# EasyEDA schematic SCH_LightScader-Mini-1.1_2026-06-06.json
TITLE: LightScader Mini; REV: 1.1; Date: 2023-11-19; Sheet: 1/1; Drawn By: robdobsn; Company: Rob Dobson
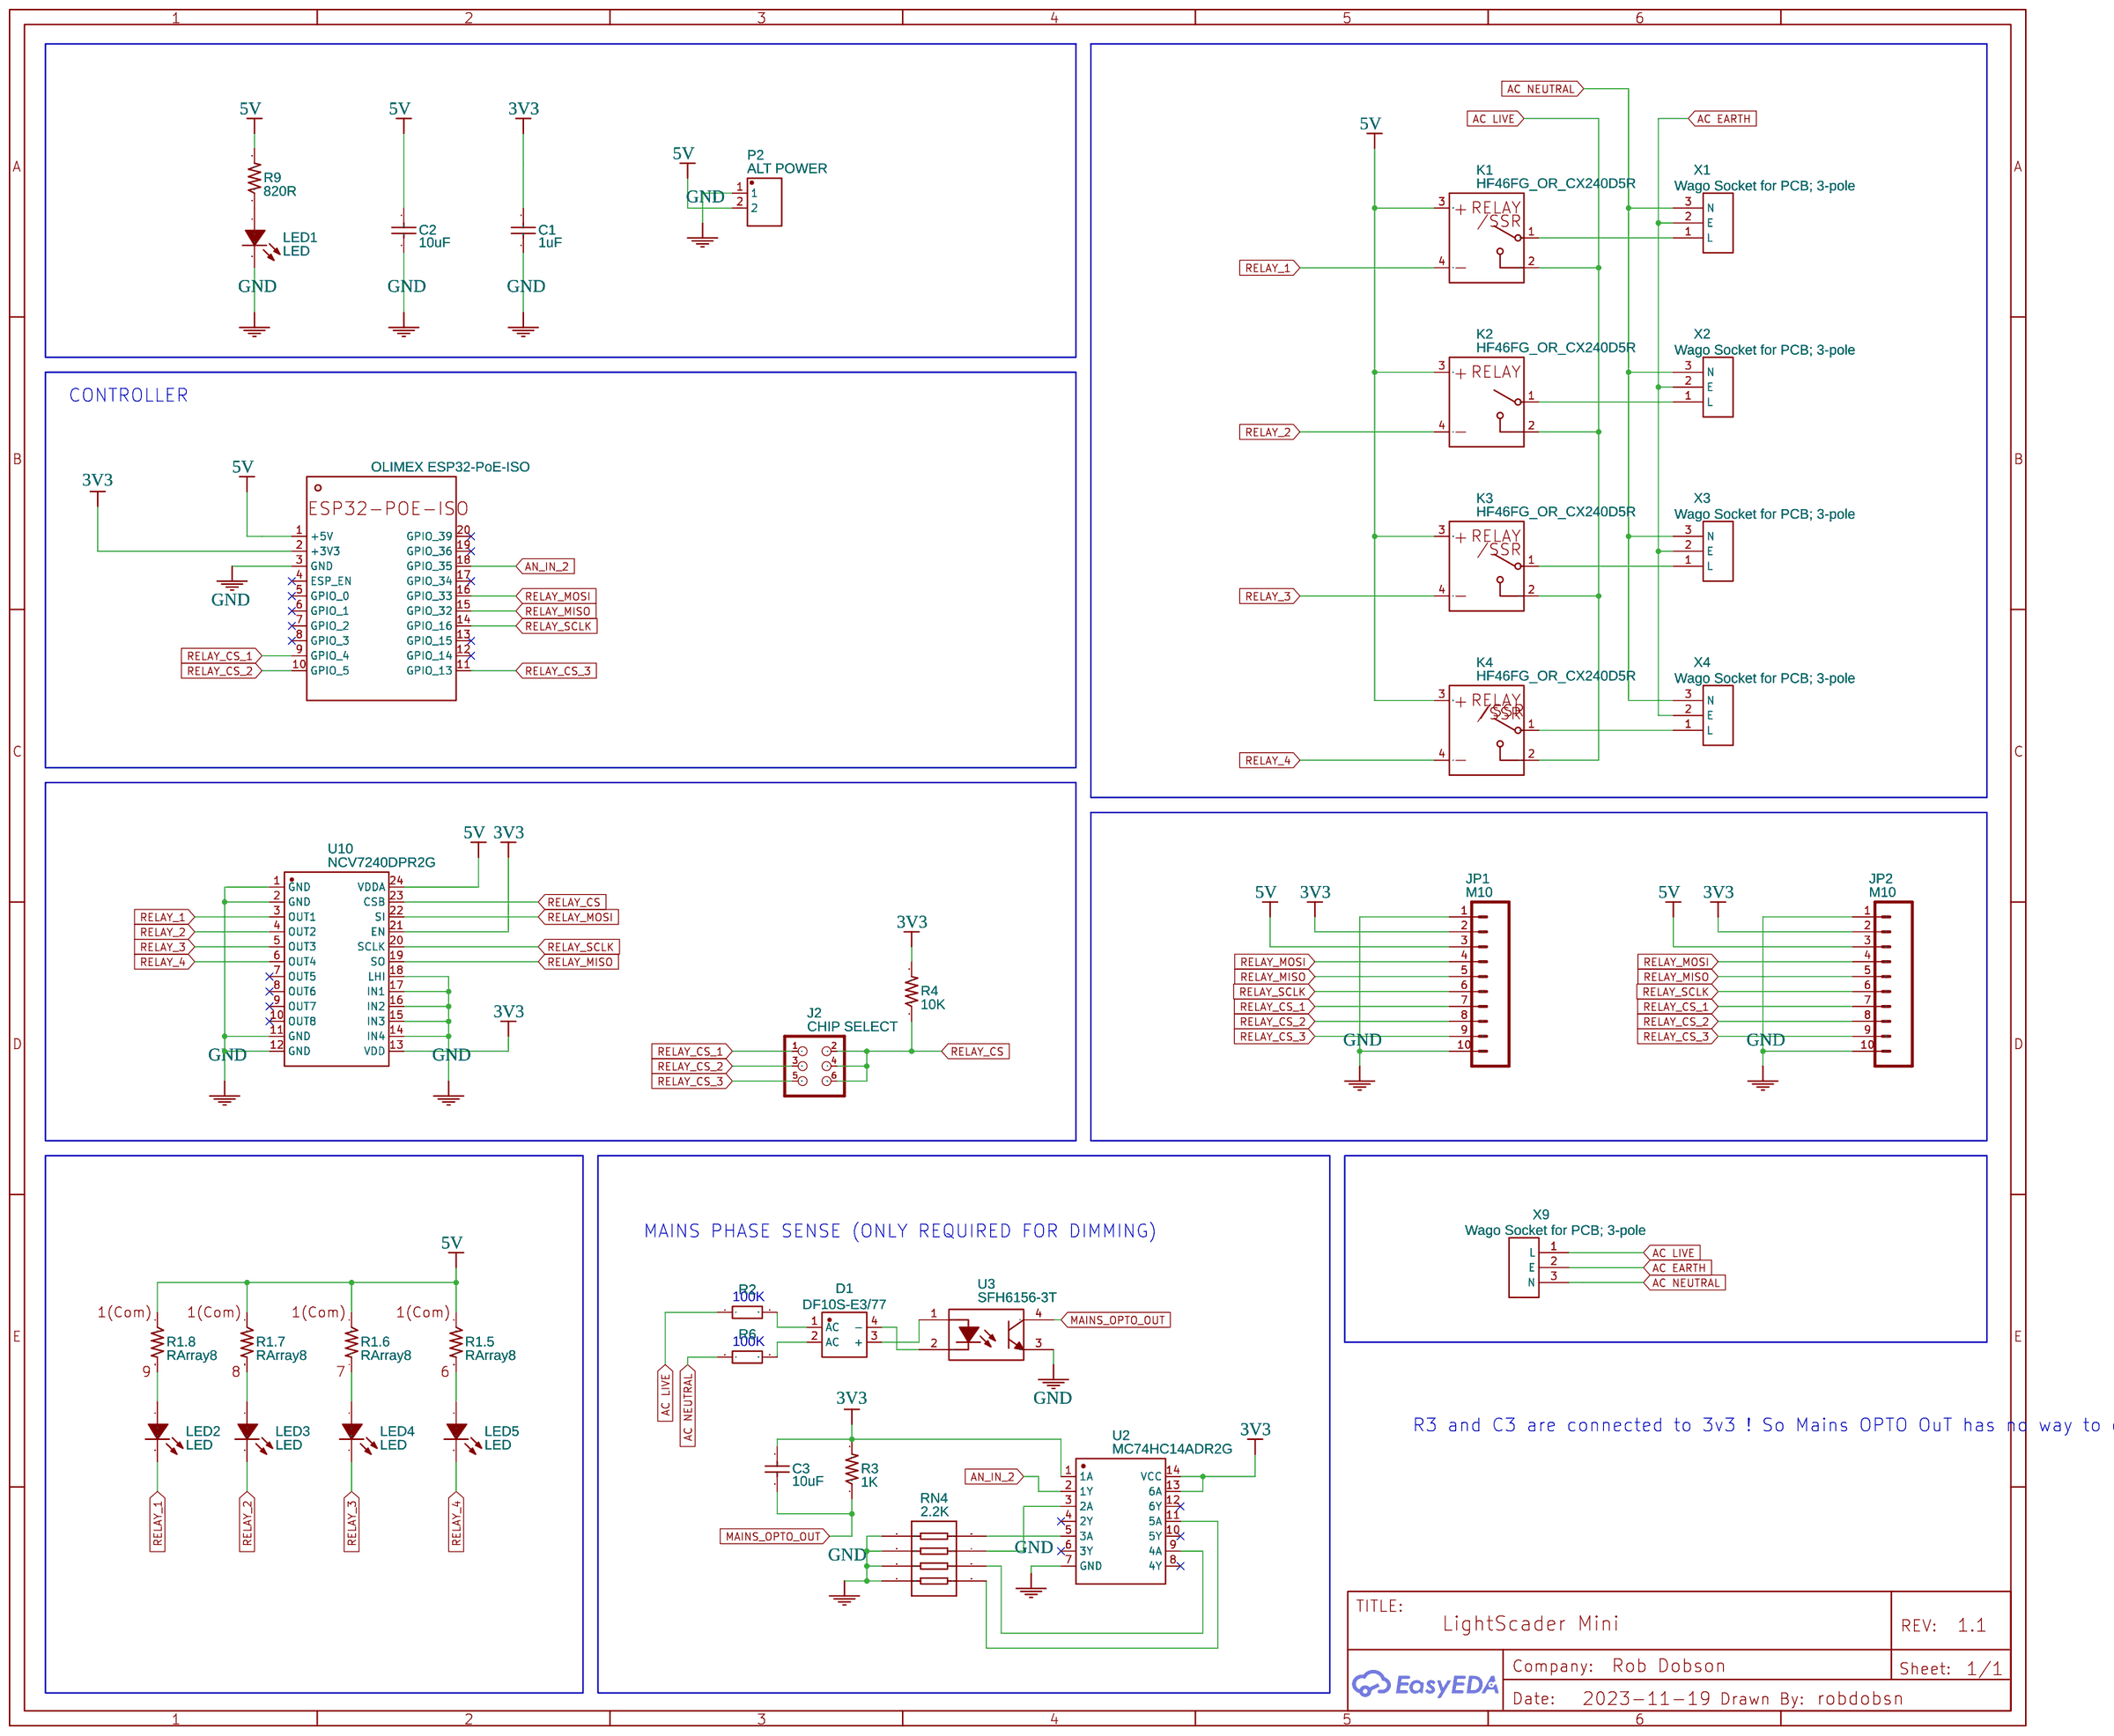
[diagram p0: schematic sheet]

## Parts
C1  1uF  [CERAMIC CAP 2.5MM LEAD SPACING]
C2  10uF  [CERAMIC CAP 2.5MM LEAD SPACING]
C3  10uF  [CERAMIC CAP 2.5MM LEAD SPACING]
D1  DF10S-E3/77  [DFS_4P-L8.3-W6.4-P5.10-LS10.1-BL]
J2  CHIP SELECT  [2X03_NO_SILK]
JP1  M10  [1X10_NO_SILK]
JP2  M10  [1X10_NO_SILK]
K1  HF46FG_OR_CX240D5R  [HF46FG_OR_CX240D5R]
K2  HF46FG_OR_CX240D5R  [HF46FG_OR_CX240D5R]
K3  HF46FG_OR_CX240D5R  [HF46FG_OR_CX240D5R]
K4  HF46FG_OR_CX240D5R  [HF46FG_OR_CX240D5R]
LED1  LED  [LED-TH_BD3.8-P2.54-FD]
LED2  LED  [LED-TH_BD3.8-P2.54-FD]
LED3  LED  [LED-TH_BD3.8-P2.54-FD]
LED4  LED  [LED-TH_BD3.8-P2.54-FD]
LED5  LED  [LED-TH_BD3.8-P2.54-FD]
NO1  OLIMEX ESP32-PoE-ISO  [OLIMEX_ESP32-POE-ISO_98MM_LONG]
P2  ALT POWER  [PCB TERMINAL BLOCK NO SILK 3.5 MM]
R1  RArray8  [RESISTOR_ARRAY_SIP_9]  (sections 5,6,7,8)
R2  NO  [R1206]
R3  1K  [AXIAL-5.0X2.5(1/4W)]
R4  10K  [AXIAL-5.0X2.5(1/4W)]
R6  NO  [R1206]
R9  820R  [AXIAL-5.0X2.5(1/4W)]
RN4  2.2K  [RES-ARRAY-SMD_0603-8P-L3.2-W1.6-BL]
U2  MC74HC14ADR2G  [SOIC-14_L8.7-W3.9-P1.27-LS6.0-BL]
U3  SFH6156-3T  [OPTO-SMD-4_L4.6-W6.5-P2.54-LS10.3-BL]
U10  NCV7240DPR2G  [SSOP-24_L8.75-W6.20-PITCH0.64-BL]
X1  Wago Socket for PCB; 3-pole  [WAGO SOCKET FOR PCBS; ANGLED; 3-POLE; COD. A]
X2  Wago Socket for PCB; 3-pole  [WAGO SOCKET FOR PCBS; ANGLED; 3-POLE; COD. A]
X3  Wago Socket for PCB; 3-pole  [WAGO SOCKET FOR PCBS; ANGLED; 3-POLE; COD. A]
X4  Wago Socket for PCB; 3-pole  [WAGO SOCKET FOR PCBS; ANGLED; 3-POLE; COD. A]
X9  Wago Socket for PCB; 3-pole  [WAGO SOCKET FOR PCBS; ANGLED; 3-POLE; COD. A]

## Library data of the parts
C1-C3 = -: Voltage: 100V; Tolerance: ±20%; Supplier Part: 9411887; Supplier: Element14; Manufacturer Part: MCFYU6104Z6; Contributor: Prof. Ing. F. Scordino; Link: http://www.farnell.com/datasheets/296858.pdf?_ga=2.179112227.664711881.1510158588-238689616.1505921947&_gac=1.162203016.1510158588.EAIaIQobChMIqoD3jrOv1wIVgwrTCh2CCwl7EAAYASAAEgKQo_D_BwE
D1 = DF10S-E3/77: Supplier: LCSC; Supplier Part: C118313; Manufacturer: VISHAY(威世); Contributor: LCSC; JLCPCB Part Class: Extended Part
J2 = -: Contributor: DangerousPrototype; sourceId: 5oAa8IGDB
JP1 JP2 = -: Contributor: SparkFun
K1 = HF46FG_OR_CX240D5R: Supplier: LCSC; Manufacturer: Hongfa; Manufacturer Part: HF46F-G; Supplier Part: C3636; link: https://hongfa.com/product/detail/b65de757-aff1-49f8-b955-95a7fcb786dc; Contributor: robdobsn; Package Display: No
K2-K4 = HF46FG_OR_CX240D5R: Supplier: LCSC; Manufacturer: Hongfa; Manufacturer Part: HF46F-G; Supplier Part: C3636; link: https://hongfa.com/product/detail/b65de757-aff1-49f8-b955-95a7fcb786dc; Contributor: robdobsn
LED1-LED5 = -: Supplier: LCSC; Manufacturer: KENTO; Manufacturer Part: LEDOrange orange 3AO4UD; image: //image.lceda.cn/szlcsc/C62095.jpg; Supplier Part: C62095
NO1 = OLIMEX ESP32-PoE-ISO: Supplier: Olimex; Contributor: robdobsn; link: https://www.olimex.com/Products/IoT/ESP32/ESP32-POE-ISO/open-source-hardware
P2 = -: Supplier: LCSC; Manufacturer: ReliaPro; Manufacturer Part: WJ2EDGV-5.08-2P; image: //image.lceda.cn/szlcsc/C8461.jpg; Contributor: robdobsn; Supplier Part: C8461
R1 = -: Contributor: robdobsn; Supplier Part: 652-4609X-1LF-10K; Supplier: Mouser; Manufacturer: Bourns; Manufacturer Part: 4609X-101-103LF; subpart_no: 1; Package Display: No
R2 R6 = CHV1206-JW-104EST: Supplier: Digi-Key; Manufacturer: Bourns Inc.; Contributor: MichaelW; Supplier Part: 118-CHV1206-JW-104ESTDKR-ND; Voltage Rated: 1.6kV
R3 R4 R9 = -: Contributor: SparkFun; Manufacturer Part: ?
RN4 = YC164-JR-072K2L: Supplier: LCSC; Manufacturer: YAGEO(国巨); Supplier Part: C136829; JLCPCB Part Class: Extended Part; Resistance: 2.2kΩ
U2 = MC74HC14ADR2G: Contributor: LCSC; Supplier: LCSC; Manufacturer: onsemi(安森美); Supplier Part: C152545; JLCPCB Part Class: Extended Part; link: https://lcsc.com/eda_search?q=C152545&%26type=1&ref=editor
U3 = SFH6156-3T: Supplier: LCSC; Manufacturer: VISHAY(威世); Contributor: LCSC; Supplier Part: C118293; JLCPCB Part Class: Extended Part
U10 = -: Supplier: LCSC; Supplier Part: C385196; Manufacturer: ON Semicon; Contributor: LCSC
X1-X4 X9 = Wago Socket for PCBs; angled; 3-pole; Cod. A: Manufacturer: Wago; Manufacturer Part: 890-803/011-000; Supplier: Rapid; Supplier Part: 21-5984; link: https://www.rapidonline.com/wago-890-803-011-000-3-pole-16a-4-4mm-pcb-mount-socket-angled-black-21-5984; Contributor: robdobsn

## Nets
3V3: C1.2 C3.2 JP1.2 JP2.2 NO1.2(+3V3) R3.2 R4.2 U2.1(1A) U2.13(6A) U2.14(VCC) U10.13(VDD) U10.21(EN)
5V: C2.2 JP1.3 JP2.3 K1.3 K2.3 K3.3 K4.3 NO1.1(+5V) P2.2 R1.1 R9.2 U10.24(VDDA)
GND: C1.1 C2.1 JP1.1 JP1.10 JP2.1 JP2.10 LED1.2(K) NO1.3(GND) P2.1 RN4.1 RN4.2 RN4.3 RN4.4 U2.7(GND) U3.3 U10.1(GND) U10.2(GND) U10.11(GND) U10.12(GND) U10.14(IN4) U10.15(IN3) U10.16(IN2) U10.17(IN1) U10.18(LHI)
AC EARTH: X1.2(E) X2.2(E) X3.2(E) X4.2(E) X9.2(E)
AC LIVE: K1.2 K2.2 K3.2 K4.2 R2.1 X9.1(L)
AC NEUTRAL: R6.1 X1.3(N) X2.3(N) X3.3(N) X4.3(N) X9.3(N)
AN_IN_2: NO1.18(GPIO 35) U2.2(1Y)
MAINS_OPTO_OUT: C3.1 R3.1 U3.4
RELAY_1: K1.4 LED2.2(K) U10.3(OUT1)
RELAY_2: K2.4 LED3.2(K) U10.4(OUT2)
RELAY_3: K3.4 LED4.2(K) U10.5(OUT3)
RELAY_4: K4.4 LED5.2(K) U10.6(OUT4)
RELAY_CS: J2.2 J2.4 J2.6 R4.1 U10.23(CSB)
RELAY_CS_1: J2.1 JP1.7 JP2.7 NO1.9(GPIO 4)
RELAY_CS_2: J2.3 JP1.8 JP2.8 NO1.10(GPIO 5)
RELAY_CS_3: J2.5 JP1.9 JP2.9 NO1.11(GPIO 13)
RELAY_MISO: JP1.5 JP2.5 NO1.15(GPIO 32) U10.19(SO)
RELAY_MOSI: JP1.4 JP2.4 NO1.16(GPIO 33) U10.22(SI)
RELAY_SCLK: JP1.6 JP2.6 NO1.14(GPIO 16) U10.20(SCLK)
Net-(D1-1): D1.1(AC) R2.2
Net-(D1-2): D1.2(AC) R6.2
Net-(D1-3): D1.3(+) U3.1
Net-(D1-4): D1.4(-) U3.2
Net-(K1-1): K1.1 X1.1(L)
Net-(K2-1): K2.1 X2.1(L)
Net-(K3-1): K3.1 X3.1(L)
Net-(K4-1): K4.1 X4.1(L)
Net-(LED1-1): LED1.1(A) R9.1
Net-(LED2-1): LED2.1(A) R1.9
Net-(LED3-1): LED3.1(A) R1.8
Net-(LED4-1): LED4.1(A) R1.7
Net-(LED5-1): LED5.1(A) R1.6
Net-(RN4-5): RN4.5 U2.11(5A)
Net-(RN4-6): RN4.6 U2.9(4A)
Net-(RN4-7): RN4.7 U2.3(2A)
Net-(RN4-8): RN4.8 U2.5(3A)

Not connected (* = marked no-connect by the designer): NO1 4(ESP_EN)* 5(GPIO 0)* 6(GPIO 1)* 7(GPIO 2)* 8(GPIO 3)* 12(GPIO 14)* 13(GPIO 15)* 17(GPIO 34)* 19(GPIO 36)* 20(GPIO 39)*; U2 4(2Y)* 6(3Y)* 8(4Y)* 10(5Y)* 12(6Y)*; U10 7(OUT5)* 8(OUT6)* 9(OUT7)* 10(OUT8)*

## Notes on the sheet
- CONTROLLER
- MAINS PHASE SENSE (ONLY REQUIRED FOR DIMMING)
- 100K
- 100K
- R3 and C3 are connected to 3v3 ! So Mains OPTO OuT has no way to drive U2
